# Altium schematic sheet NTC.SchDoc
size A4; SheetNumber: 6; SheetTotal: 6
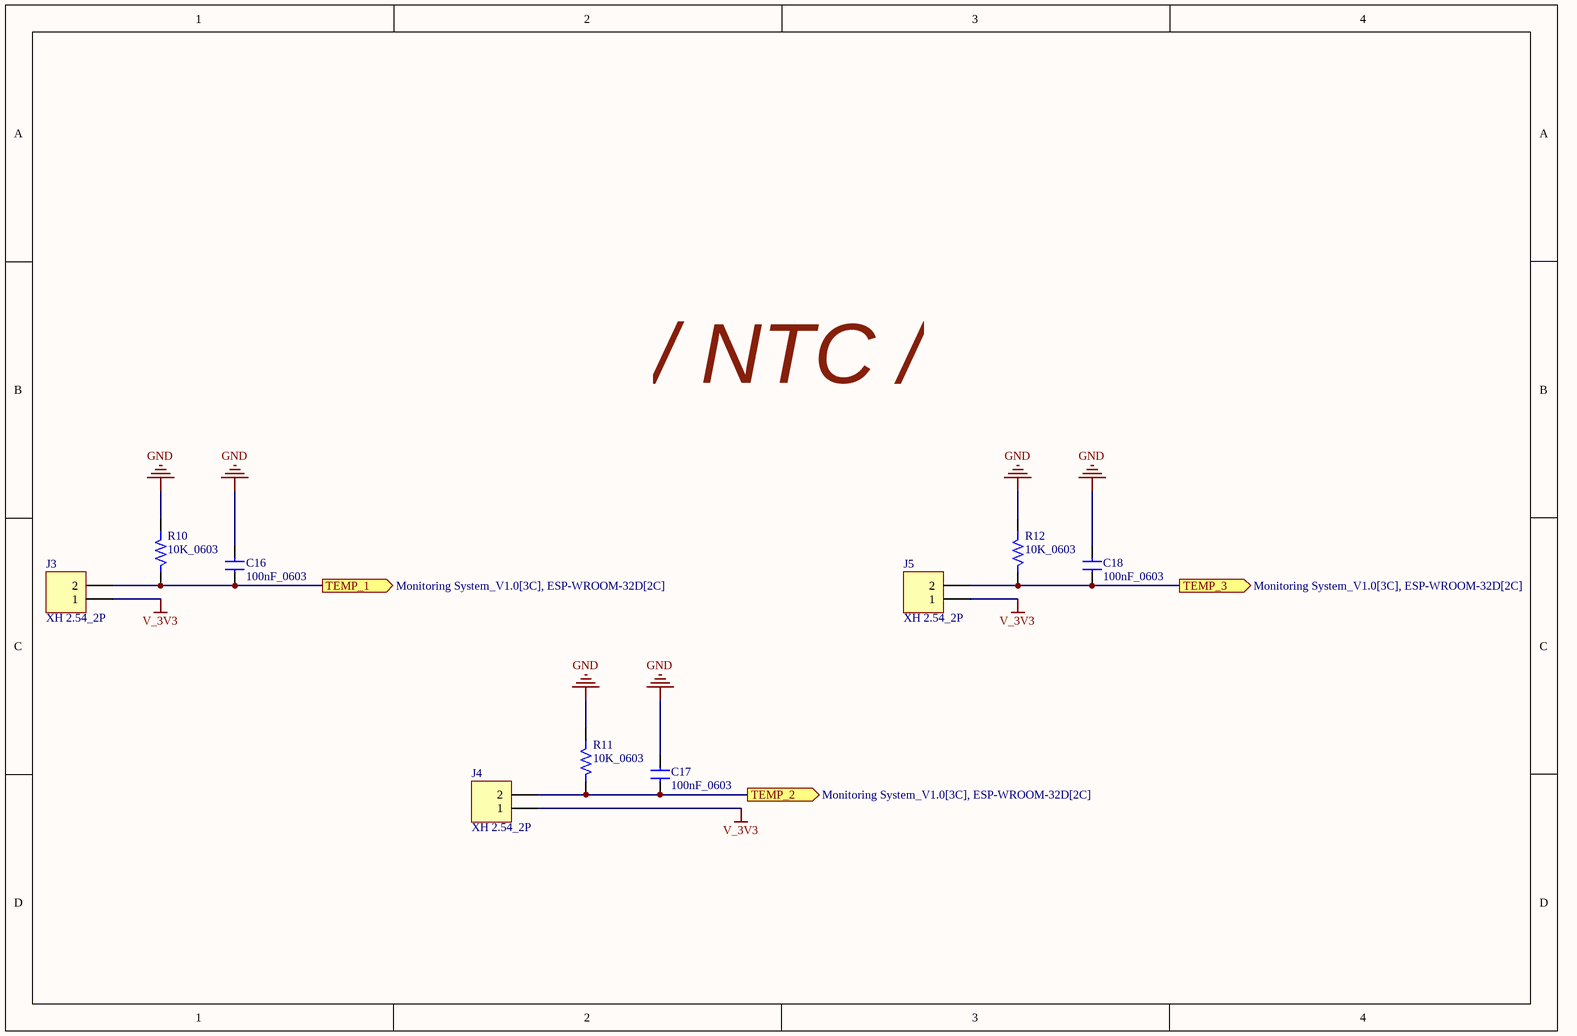
[diagram p0: NTC.SchDoc]

## Parts
C16  100nF_0603  [CN-SMD-0603]
C17  100nF_0603  [CN-SMD-0603]
C18  100nF_0603  [CN-SMD-0603]
J3  XH 2.54_2P  [Header2]
J4  XH 2.54_2P  [Header2]
J5  XH 2.54_2P  [Header2]
R10  10K_0603  [RES-SMD-0603]
R11  10K_0603  [RES-SMD-0603]
R12  10K_0603  [RES-SMD-0603]

## Ports
TEMP_1 (out, see Monitoring System_V1.0[3C], ESP-WROOM-32D[2C]), TEMP_2 (out, see Monitoring System_V1.0[3C], ESP-WROOM-32D[2C]), TEMP_3 (out, see Monitoring System_V1.0[3C], ESP-WROOM-32D[2C])

## Nets
GND: C16.2 C17.2 C18.2 R10.2 R11.2 R12.2
V_3V3: J3.1 J4.1 J5.1
TEMP_1: C16.1 J3.2 R10.1 ; port TEMP_1
TEMP_2: C17.1 J4.2 R11.1 ; port TEMP_2
TEMP_3: C18.1 J5.2 R12.1 ; port TEMP_3

## Notes on the sheet
- / NTC /

## Library data of the parts
C16-C18 = CAP 0603 104: Cap SMD, 0.06x0.03 inch, 1.55x0.85 mm - 1608
R10-R12 = RES 0603 10K: Resistor SMD, 0.06x0.03 inch, 1.55x0.85 mm - 1608, 1/10W